# Altium schematic sheet Transistors.SchDoc
size A; SheetNumber: 2; SheetTotal: 2
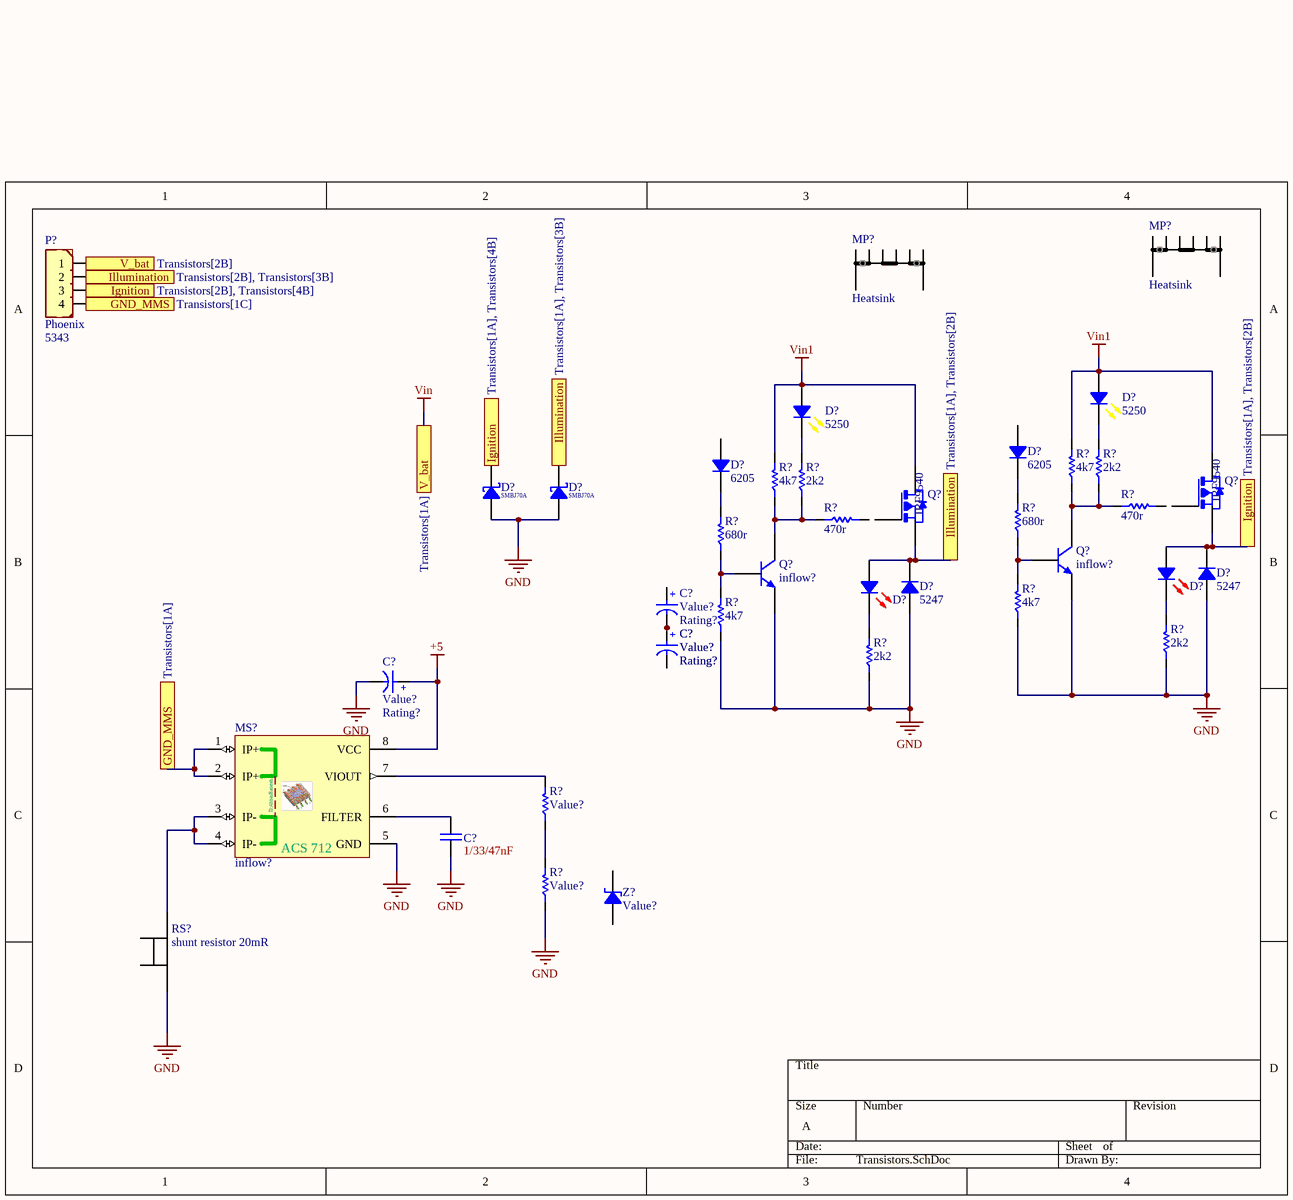
[diagram p0: Transistors.SchDoc]

## Parts
(Parts that share a designator on the sheet are numbered #1, #2 ... from top to bottom, then left to right.)
C?#1  Rating: Rating?  [SMT_C_Tantalum_A]  (hidden comment: Value?)
C?#2  Rating: Rating?  [SMT_C_Tantalum_A]  (hidden comment: Value?)
C?#3  Rating: Rating?  [SMT_C_Tantalum_A]  (hidden comment: Value?)
C?#4  Rating: Rating?  [SMT_C_Tantalum_A]  (hidden comment: Value?)
C?#5  1/33/47nF  [CAP 1206/3216]
D?#1  Inflow: 5250  [LED 1206/3216 YELLOW]  (hidden comment: Yellow, 1206)
D?#2  Inflow: 5250  [LED 1206/3216 YELLOW]  (hidden comment: Yellow, 1206)
D?#3  Inflow: 6205  [LL4148]  (hidden comment: 1N4148)
D?#4  Inflow: 6205  [LL4148]  (hidden comment: 1N4148)
D?#5  SMBJ70A  [DO214AA SMB]
D?#6  SMBJ70A  [DO214AA SMB]
D?#7  Red, 1206  [LED 1206/3216 RED]  (value not drawn)
D?#8  Red, 1206  [LED 1206/3216 RED]  (value not drawn)
D?#9  Inflow: 5247  [DO214AC SMA]  (hidden comment: 1N4007)
D?#10  Inflow: 5247  [DO214AC SMA]  (hidden comment: 1N4007)
MP?#1  Heatsink  [Heatsink]
MP?#2  Heatsink  [Heatsink]
MS?  Inflow: inflow?  [8S2_N]  (hidden comment: ACS712-5A)
P?  Inflow: 5343  [Phoenix_4PIN_RA_P5.08mm]  (hidden comment: Phoenix)
Q?#1  Inflow: IRF9540  [TO-220AB]  (hidden comment: IRF9Z24)
Q?#2  Inflow: IRF9540  [TO-220AB]  (hidden comment: IRF9Z24)
Q?#3  Inflow: inflow?  [SOT23_N]  (hidden comment: NPN)
Q?#4  Inflow: inflow?  [SOT23_N]  (hidden comment: NPN)
R?#1  4k7  [RES 1206 (3216X08L)]
R?#2  2k2  [RES 1206 (3216X08L)]
R?#3  4k7  [RES 1206 (3216X08L)]
R?#4  2k2  [RES 1206 (3216X08L)]
R?#5  470r  [RES 1206 (3216X08L)]
R?#6  470r  [RES 1206 (3216X08L)]
R?#7  680r  [RES 1206 (3216X08L)]
R?#8  680r  [RES 1206 (3216X08L)]
R?#9  4k7  [RES 1206 (3216X08L)]
R?#10  4k7  [RES 1206 (3216X08L)]
R?#11  2k2  [RES 1206 (3216X08L)]
R?#12  2k2  [RES 1206 (3216X08L)]
R?#13  Value?  [RES 1206 (3216X08L)]
R?#14  Value?  [RES 1206 (3216X08L)]
RS?  shunt resistor 20mR  [shunt resistor]
Z?  Value?  [SOD80, LL-34]

## Ports
GND_MMS (see Transistors[1A]), GND_MMS (see Transistors[1C]), Ignition (see Transistors[1A], Transistors[2B]), Ignition (see Transistors[1A], Transistors[4B]), Ignition (see Transistors[2B], Transistors[4B]), Illumination (see Transistors[1A], Transistors[2B]), Illumination (see Transistors[1A], Transistors[3B]), Illumination (see Transistors[2B], Transistors[3B]), V_bat (see Transistors[1A]), V_bat (see Transistors[2B])

## Nets
+5: C?#4.1(+) MS?.8(VCC)
GND: C?#4.2(-) C?#5.2 D?#5.1 D?#6.1 D?#9.1 D?#10.1 MS?.5(GND) Q?#3.2(E) Q?#4.2(E) R?#9.1 R?#10.1 R?#11.1 R?#12.1 R?#14.1 RS?.1
Vin: P?.1 ; port V_bat
Vin1: D?#1.1 D?#2.1 Q?#1.3(S) Q?#2.3(S) R?#1.2 R?#3.2
GND_MMS: MS?.1(IP+) MS?.2(IP+) P?.4 ; port GND_MMS
Ignition: D?#5.2 D?#7.1 D?#9.2 P?.3 Q?#1.2(D) ; port Ignition
Illumination: D?#6.2 D?#8.1 D?#10.2 P?.2 Q?#2.2(D) ; port Illumination
NetC?#1_2: C?#1.2(-) C?#2.1(+) C?#3.1(+)
NetC?#2_2: C?#2.2(-) C?#3.2(-)
NetC?#5_1: C?#5.1 MS?.6(FILTER)
NetD?#1_2: D?#1.2 R?#2.2
NetD?#2_2: D?#2.2 R?#4.2
NetD?#3_2: D?#3.2 R?#7.2
NetD?#4_2: D?#4.2 R?#8.2
NetD?#7_2: D?#7.2 R?#11.2
NetD?#8_2: D?#8.2 R?#12.2
NetMS?_3: MS?.3(IP-) MS?.4(IP-) RS?.2
NetMS?_7: MS?.7(VIOUT) R?#13.2
NetQ?#3_1: Q?#3.1(B) R?#7.1 R?#9.2
NetQ?#3_3: Q?#3.3(C) R?#1.1 R?#2.1 R?#5.1
NetQ?#4_1: Q?#4.1(B) R?#8.1 R?#10.2
NetQ?#4_3: Q?#4.3(C) R?#3.1 R?#4.1 R?#6.1
NetR?#13_1: R?#13.1 R?#14.2

Not connected (* = marked no-connect by the designer): C?#1 1(+); D?#3 1; D?#4 1; MP?#1 1 2; MP?#2 1 2; Q?#1 1(G); Q?#2 1(G); R?#5 2; R?#6 2; Z? 1 2

## Notes on the sheet
- (in symbol ModSen_ACS712ELCTR) D:AbbasBasereh; ACS 712

## Library data of the parts
C?#1-C?#4 = Cap_Tantalum: Tantalum Capacitor,TAJ Series-SMD; Inflow: inflow?; Validation: Valid; Package: Package?; Type: Tantalum; Value: Value?
C?#5 = Cap_Multi_SMD_100nF_1206: Bipolar ceramic capacitor SMD; Type: MultiLayer; Inflow: inflow?; Rating: 50V; Validation: Valid; Value: 100n; Package: 1206
D?#1 D?#2 = Semi_LED_Yellow_1206: LED; Rating: Rating?; Type: Type?; Validation: Valid; Value: Yellow, 1206; Package: Package?
D?#3 D?#4 = Semi_Diod_STD_1N4148_MELF: High Conductance Fast Diode; Rating: Rating?; Type: Type?; Validation: NT; Value: 1N4148; Package: Package?
D?#5 D?#6 = Semi_Diod_TVS_SMBJ15A: Transil diodes provide high overvoltage protection by clamping action; Rating: 15V; Type: TVS; Validation: Valid; Inflow: inflow?; Value: SMBJ15A; Package: SMB
D?#7 D?#8 = Semi_LED_Red_1206: LED; Inflow: 5253; Rating: Rating?; Type: Type?; Validation: Valid; Value: Red, 1206; Package: Package?
D?#9 D?#10 = Semi_Diod_STD_1N4007_SMD: General purpose rectifiers; Rating: Rating?; Type: Type?; Validation: Valid; Value: 1N4007; Package: Package?
MS? = ModSen_ACS712ELCTR: Fully Integrated, Hall Effect-Based Linear Current Sensor IC  with 2.1 kVRMS Isolation and a Low-Resistance Current Conductor; Rating: Rating?; Validation: NT; Value: ACS712-5A; Package: Package?; Type: Type?
P? = Con_Power_4_Ph_R: Phoenix Power Connector 4'Pin; Rating: 4b; Validation: Valid; Package: Dip; Type: Right; Value: Phoenix
Q?#1 Q?#2 = IRF9Z24: P-Channel MOSFET; Rating: Rating?; Type: Type?; Validation: NT; Value: P-Channel; Package: Package?
Q?#3 Q?#4 = Semi_BJT_BC817: NPN General purpose Transistor; Rating: Rating?; Type: Type?; Validation: Valid; Value: NPN; Package: Package?
R?#1-R?#12 = Res_SMD: Resistor; Inflow: inflow?; Rating: Rating?; Validation: Valid; Value: Value?; Package: Package?; Type: 10%
R?#13 R?#14 = Res_SMD: Resistor; Inflow: inflow?; Rating: Rating?; Validation: Valid; Package: Package?; Type: 10%; Value: Value?
RS? = shunt resistor
Z? = Semi_Diod_Zener_SMD: Zener Diode; Rating: Rating?; Inflow: inflow?; Validation: Valid; Type: Zener; Package: SOD-80; Value: Value?